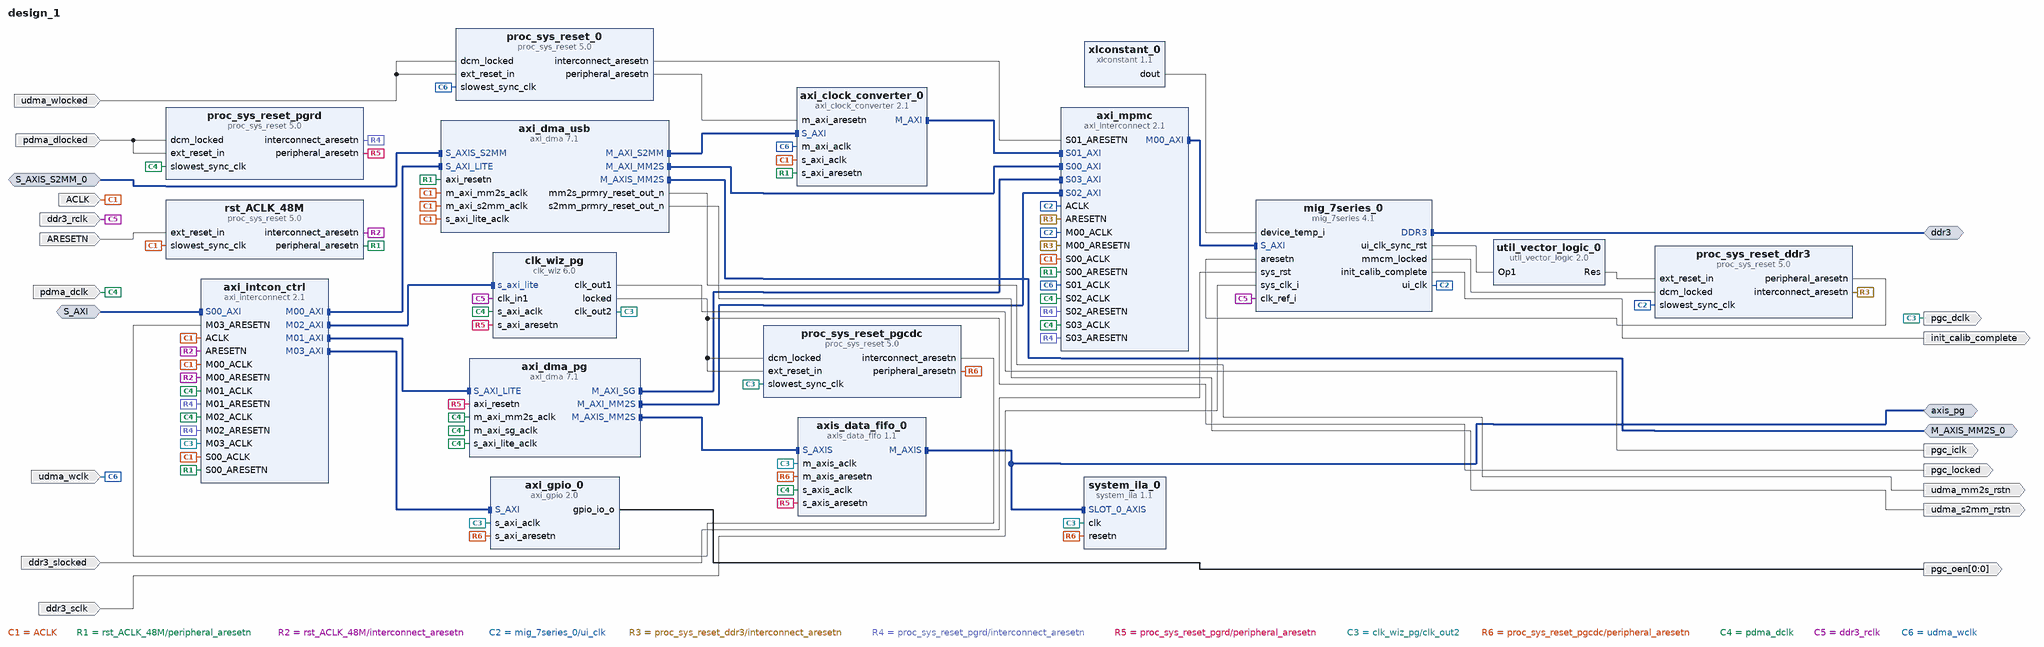
[diagram p0: block diagram of the top level]
# Vivado block design design_1, xc7a35tcsg324-1, Vivado 2018.2
create_bd_design design_1

create_bd_intf_port -mode Slave -vlnv xilinx.com:interface:axis_rtl:1.0 S_AXIS_S2MM_0
set_property -dict [list \
  CONFIG.TDATA_NUM_BYTES 4 \
  CONFIG.TDEST_WIDTH 0 \
  CONFIG.TID_WIDTH 0 \
  CONFIG.TUSER_WIDTH 0 \
  CONFIG.HAS_TREADY 1 \
  CONFIG.HAS_TSTRB 0 \
  CONFIG.HAS_TKEEP 1 \
  CONFIG.HAS_TLAST 1 \
  CONFIG.FREQ_HZ 48000000 \
  CONFIG.LAYERED_METADATA undef \
] [get_bd_intf_ports S_AXIS_S2MM_0]
create_bd_intf_port -mode Slave -vlnv xilinx.com:interface:aximm_rtl:1.0 S_AXI
set_property -dict [list \
  CONFIG.DATA_WIDTH 32 \
  CONFIG.PROTOCOL AXI4 \
  CONFIG.FREQ_HZ 48000000 \
  CONFIG.ID_WIDTH 1 \
  CONFIG.ADDR_WIDTH 32 \
  CONFIG.AWUSER_WIDTH 0 \
  CONFIG.ARUSER_WIDTH 0 \
  CONFIG.WUSER_WIDTH 0 \
  CONFIG.RUSER_WIDTH 0 \
  CONFIG.BUSER_WIDTH 0 \
  CONFIG.READ_WRITE_MODE READ_WRITE \
  CONFIG.HAS_BURST 1 \
  CONFIG.HAS_LOCK 1 \
  CONFIG.HAS_PROT 1 \
  CONFIG.HAS_CACHE 1 \
  CONFIG.HAS_QOS 1 \
  CONFIG.HAS_REGION 1 \
  CONFIG.HAS_WSTRB 1 \
  CONFIG.HAS_BRESP 1 \
  CONFIG.HAS_RRESP 1 \
  CONFIG.SUPPORTS_NARROW_BURST 0 \
  CONFIG.NUM_READ_OUTSTANDING 0 \
  CONFIG.NUM_WRITE_OUTSTANDING 0 \
  CONFIG.MAX_BURST_LENGTH 1 \
  CONFIG.NUM_READ_THREADS 1 \
  CONFIG.NUM_WRITE_THREADS 1 \
  CONFIG.RUSER_BITS_PER_BYTE 0 \
  CONFIG.WUSER_BITS_PER_BYTE 0 \
] [get_bd_intf_ports S_AXI]
create_bd_intf_port -mode Master -vlnv xilinx.com:interface:ddrx_rtl:1.0 ddr3
create_bd_intf_port -mode Master -vlnv xilinx.com:interface:axis_rtl:1.0 M_AXIS_MM2S_0
set_property -dict {CONFIG.FREQ_HZ 48000000} [get_bd_intf_ports M_AXIS_MM2S_0]
create_bd_intf_port -mode Master -vlnv xilinx.com:interface:axis_rtl:1.0 axis_pg
set_property -dict {CONFIG.FREQ_HZ 74250000} [get_bd_intf_ports axis_pg]
create_bd_port -dir I -type clk ACLK
set_property -dict {CONFIG.FREQ_HZ 48000000} [get_bd_ports ACLK]
create_bd_port -dir I ARESETN
create_bd_port -dir I ddr3_slocked
create_bd_port -dir O init_calib_complete
create_bd_port -dir O -type clk pgc_iclk
create_bd_port -dir O -type clk pgc_dclk
create_bd_port -dir O pgc_locked
create_bd_port -dir O -from 0 -to 0 pgc_oen
create_bd_port -dir I -type clk pdma_dclk
set_property -dict {CONFIG.FREQ_HZ 125000000} [get_bd_ports pdma_dclk]
create_bd_port -dir I pdma_dlocked
create_bd_port -dir I -type clk ddr3_sclk
set_property -dict {CONFIG.FREQ_HZ 400000000} [get_bd_ports ddr3_sclk]
create_bd_port -dir O -type rst udma_mm2s_rstn
create_bd_port -dir O -type rst udma_s2mm_rstn
create_bd_port -dir I -type clk ddr3_rclk
set_property -dict {CONFIG.FREQ_HZ 200000000} [get_bd_ports ddr3_rclk]
create_bd_port -dir I udma_wlocked
create_bd_port -dir I -type clk udma_wclk
set_property -dict {CONFIG.FREQ_HZ 12500000} [get_bd_ports udma_wclk]

create_bd_cell -type ip -vlnv xilinx.com:ip:proc_sys_reset:5.0 rst_ACLK_48M
create_bd_cell -type ip -vlnv xilinx.com:ip:mig_7series:4.1 mig_7series_0
set_property -dict [list \
  CONFIG.XML_INPUT_FILE mig_a.prj \
  CONFIG.RESET_BOARD_INTERFACE Custom \
  CONFIG.MIG_DONT_TOUCH_PARAM Custom \
  CONFIG.BOARD_MIG_PARAM Custom \
] [get_bd_cells mig_7series_0]
create_bd_cell -type ip -vlnv xilinx.com:ip:proc_sys_reset:5.0 proc_sys_reset_ddr3
create_bd_cell -type ip -vlnv xilinx.com:ip:util_vector_logic:2.0 util_vector_logic_0
set_property -dict {CONFIG.C_SIZE 1 CONFIG.C_OPERATION not} [get_bd_cells util_vector_logic_0]
create_bd_cell -type ip -vlnv xilinx.com:ip:proc_sys_reset:5.0 proc_sys_reset_pgrd
create_bd_cell -type ip -vlnv xilinx.com:ip:proc_sys_reset:5.0 proc_sys_reset_pgcdc
create_bd_cell -type ip -vlnv xilinx.com:ip:proc_sys_reset:5.0 proc_sys_reset_0
create_bd_cell -type ip -vlnv xilinx.com:ip:axi_clock_converter:2.1 axi_clock_converter_0
create_bd_cell -type ip -vlnv xilinx.com:ip:axi_dma:7.1 axi_dma_usb
set_property -dict [list \
  CONFIG.c_include_sg 0 \
  CONFIG.c_sg_length_width 24 \
  CONFIG.c_m_axi_mm2s_data_width 32 \
  CONFIG.c_mm2s_burst_size 16 \
  CONFIG.c_single_interface 0 \
] [get_bd_cells axi_dma_usb]
create_bd_cell -type ip -vlnv xilinx.com:ip:axi_dma:7.1 axi_dma_pg
set_property -dict [list \
  CONFIG.c_sg_length_width 26 \
  CONFIG.c_sg_include_stscntrl_strm 0 \
  CONFIG.c_m_axi_mm2s_data_width 128 \
  CONFIG.c_mm2s_burst_size 128 \
  CONFIG.c_include_s2mm 0 \
] [get_bd_cells axi_dma_pg]
create_bd_cell -type ip -vlnv xilinx.com:ip:axi_gpio:2.0 axi_gpio_0
set_property -dict {CONFIG.C_TRI_DEFAULT 0x00000000 CONFIG.C_GPIO_WIDTH 1} [get_bd_cells axi_gpio_0]
create_bd_cell -type ip -vlnv xilinx.com:ip:axi_interconnect:2.1 axi_intcon_ctrl
set_property -dict {CONFIG.NUM_MI 4} [get_bd_cells axi_intcon_ctrl]
create_bd_cell -type ip -vlnv xilinx.com:ip:axi_interconnect:2.1 axi_mpmc
set_property -dict [list \
  CONFIG.NUM_SI 4 \
  CONFIG.NUM_MI 1 \
  CONFIG.ENABLE_ADVANCED_OPTIONS 1 \
  CONFIG.XBAR_DATA_WIDTH 128 \
  CONFIG.S00_HAS_DATA_FIFO 2 \
  CONFIG.S01_HAS_DATA_FIFO 2 \
  CONFIG.S02_HAS_DATA_FIFO 2 \
  CONFIG.S03_HAS_DATA_FIFO 2 \
] [get_bd_cells axi_mpmc]
create_bd_cell -type ip -vlnv xilinx.com:ip:axis_data_fifo:1.1 axis_data_fifo_0
set_property -dict {CONFIG.FIFO_DEPTH 2048 CONFIG.IS_ACLK_ASYNC 1} [get_bd_cells axis_data_fifo_0]
create_bd_cell -type ip -vlnv xilinx.com:ip:clk_wiz:6.0 clk_wiz_pg
set_property -dict [list \
  CONFIG.USE_DYN_RECONFIG true \
  CONFIG.PRIM_IN_FREQ 200.000 \
  CONFIG.CLKIN1_JITTER_PS 50.0 \
  CONFIG.CLKOUT2_USED true \
  CONFIG.NUM_OUT_CLKS 2 \
  CONFIG.CLKOUT1_REQUESTED_OUT_FREQ 371.25 \
  CONFIG.CLKOUT2_REQUESTED_OUT_FREQ 74.25 \
  CONFIG.MMCM_DIVCLK_DIVIDE 10 \
  CONFIG.MMCM_CLKFBOUT_MULT_F 37.125 \
  CONFIG.MMCM_CLKIN1_PERIOD 5.000 \
  CONFIG.MMCM_CLKIN2_PERIOD 10.0 \
  CONFIG.MMCM_CLKOUT0_DIVIDE_F 2.000 \
  CONFIG.MMCM_CLKOUT1_DIVIDE 10 \
  CONFIG.CLKOUT1_JITTER 256.477 \
  CONFIG.CLKOUT1_PHASE_ERROR 322.999 \
  CONFIG.CLKOUT2_JITTER 333.287 \
  CONFIG.CLKOUT2_PHASE_ERROR 322.999 \
] [get_bd_cells clk_wiz_pg]
create_bd_cell -type ip -vlnv xilinx.com:ip:xlconstant:1.1 xlconstant_0
set_property -dict {CONFIG.CONST_WIDTH 12 CONFIG.CONST_VAL 0} [get_bd_cells xlconstant_0]
create_bd_cell -type ip -vlnv xilinx.com:ip:system_ila:1.1 system_ila_0
set_property -dict [list \
  CONFIG.C_SLOT_0_APC_EN 0 \
  CONFIG.C_SLOT_0_AXI_DATA_SEL 1 \
  CONFIG.C_SLOT_0_AXI_TRIG_SEL 1 \
  CONFIG.C_NUM_MONITOR_SLOTS 1 \
  CONFIG.C_SLOT_0_INTF_TYPE xilinx.com:interface:axis_rtl:1.0 \
  CONFIG.C_MON_TYPE INTERFACE \
] [get_bd_cells system_ila_0]

# ---- connections ----

connect_bd_intf_net -intf_net axi_interconnect_0_M00_AXI [get_bd_intf_pins axi_intcon_ctrl/M00_AXI] [get_bd_intf_pins axi_dma_usb/S_AXI_LITE]
connect_bd_intf_net [get_bd_intf_pins mig_7series_0/S_AXI] [get_bd_intf_pins axi_mpmc/M00_AXI]
connect_bd_intf_net -intf_net axi_dma_0_M_AXI_MM2S [get_bd_intf_pins axi_dma_usb/M_AXI_MM2S] [get_bd_intf_pins axi_mpmc/S00_AXI]
connect_bd_intf_net -intf_net axi_interconnect_0_M01_AXI [get_bd_intf_pins axi_intcon_ctrl/M01_AXI] [get_bd_intf_pins axi_dma_pg/S_AXI_LITE]
connect_bd_intf_net [get_bd_intf_pins axi_dma_pg/M_AXI_SG] [get_bd_intf_pins axi_mpmc/S03_AXI]
connect_bd_intf_net [get_bd_intf_pins axi_dma_pg/M_AXI_MM2S] [get_bd_intf_pins axi_mpmc/S02_AXI]
connect_bd_intf_net [get_bd_intf_pins axi_intcon_ctrl/M02_AXI] [get_bd_intf_pins clk_wiz_pg/s_axi_lite]
connect_bd_intf_net [get_bd_intf_pins axi_dma_pg/M_AXIS_MM2S] [get_bd_intf_pins axis_data_fifo_0/S_AXIS]
connect_bd_intf_net [get_bd_intf_pins axi_intcon_ctrl/M03_AXI] [get_bd_intf_pins axi_gpio_0/S_AXI]
connect_bd_intf_net [get_bd_intf_pins axi_dma_usb/M_AXI_S2MM] [get_bd_intf_pins axi_clock_converter_0/S_AXI]
connect_bd_intf_net [get_bd_intf_pins axi_clock_converter_0/M_AXI] [get_bd_intf_pins axi_mpmc/S01_AXI]
connect_bd_intf_net -intf_net S_AXIS_S2MM_0_1 [get_bd_intf_ports S_AXIS_S2MM_0] [get_bd_intf_pins axi_dma_usb/S_AXIS_S2MM]
connect_bd_intf_net [get_bd_intf_ports S_AXI] [get_bd_intf_pins axi_intcon_ctrl/S00_AXI]
connect_bd_intf_net [get_bd_intf_ports ddr3] [get_bd_intf_pins mig_7series_0/DDR3]
connect_bd_intf_net [get_bd_intf_ports M_AXIS_MM2S_0] [get_bd_intf_pins axi_dma_usb/M_AXIS_MM2S]
connect_bd_intf_net [get_bd_intf_ports axis_pg] [get_bd_intf_pins axis_data_fifo_0/M_AXIS]
connect_bd_intf_net [get_bd_intf_ports axis_pg] [get_bd_intf_pins system_ila_0/SLOT_0_AXIS]
connect_bd_net [get_bd_ports ACLK] \
  [get_bd_pins rst_ACLK_48M/slowest_sync_clk] [get_bd_pins axi_clock_converter_0/s_axi_aclk] \
  [get_bd_pins axi_dma_usb/s_axi_lite_aclk] [get_bd_pins axi_dma_usb/m_axi_mm2s_aclk] \
  [get_bd_pins axi_dma_usb/m_axi_s2mm_aclk] [get_bd_pins axi_intcon_ctrl/ACLK] [get_bd_pins axi_intcon_ctrl/S00_ACLK] \
  [get_bd_pins axi_intcon_ctrl/M00_ACLK] [get_bd_pins axi_mpmc/S00_ACLK]
connect_bd_net [get_bd_pins rst_ACLK_48M/peripheral_aresetn] \
  [get_bd_pins axi_clock_converter_0/s_axi_aresetn] [get_bd_pins axi_dma_usb/axi_resetn] \
  [get_bd_pins axi_intcon_ctrl/S00_ARESETN] [get_bd_pins axi_mpmc/S00_ARESETN]
connect_bd_net [get_bd_ports ARESETN] [get_bd_pins rst_ACLK_48M/ext_reset_in]
connect_bd_net [get_bd_pins rst_ACLK_48M/interconnect_aresetn] [get_bd_pins axi_intcon_ctrl/ARESETN] [get_bd_pins axi_intcon_ctrl/M00_ARESETN]
connect_bd_net [get_bd_pins xlconstant_0/dout] [get_bd_pins mig_7series_0/device_temp_i]
connect_bd_net [get_bd_ports ddr3_slocked] [get_bd_pins mig_7series_0/sys_rst]
connect_bd_net [get_bd_pins mig_7series_0/ui_clk] \
  [get_bd_pins proc_sys_reset_ddr3/slowest_sync_clk] [get_bd_pins axi_mpmc/ACLK] [get_bd_pins axi_mpmc/M00_ACLK]
connect_bd_net [get_bd_pins mig_7series_0/mmcm_locked] [get_bd_pins proc_sys_reset_ddr3/dcm_locked]
connect_bd_net [get_bd_pins mig_7series_0/ui_clk_sync_rst] [get_bd_pins util_vector_logic_0/Op1]
connect_bd_net [get_bd_pins util_vector_logic_0/Res] [get_bd_pins proc_sys_reset_ddr3/ext_reset_in]
connect_bd_net -net proc_sys_reset_0_peripheral_aresetn [get_bd_pins proc_sys_reset_ddr3/peripheral_aresetn] [get_bd_pins mig_7series_0/aresetn]
connect_bd_net [get_bd_pins mig_7series_0/init_calib_complete] [get_bd_ports init_calib_complete]
connect_bd_net -net proc_sys_reset_0_interconnect_aresetn [get_bd_pins proc_sys_reset_ddr3/interconnect_aresetn] \
  [get_bd_pins axi_mpmc/ARESETN] [get_bd_pins axi_mpmc/M00_ARESETN]
connect_bd_net -net M01_ARESETN_1 [get_bd_pins proc_sys_reset_pgrd/interconnect_aresetn] \
  [get_bd_pins axi_intcon_ctrl/M01_ARESETN] [get_bd_pins axi_intcon_ctrl/M02_ARESETN] [get_bd_pins axi_mpmc/S02_ARESETN] \
  [get_bd_pins axi_mpmc/S03_ARESETN]
connect_bd_net -net proc_sys_reset_pg_peripheral_aresetn [get_bd_pins proc_sys_reset_pgrd/peripheral_aresetn] \
  [get_bd_pins axi_dma_pg/axi_resetn] [get_bd_pins axis_data_fifo_0/s_axis_aresetn] [get_bd_pins clk_wiz_pg/s_axi_aresetn]
connect_bd_net [get_bd_pins clk_wiz_pg/clk_out1] [get_bd_ports pgc_iclk]
connect_bd_net [get_bd_pins clk_wiz_pg/clk_out2] \
  [get_bd_ports pgc_dclk] [get_bd_pins proc_sys_reset_pgcdc/slowest_sync_clk] [get_bd_pins axi_gpio_0/s_axi_aclk] \
  [get_bd_pins axis_data_fifo_0/m_axis_aclk] [get_bd_pins axi_intcon_ctrl/M03_ACLK] [get_bd_pins system_ila_0/clk]
connect_bd_net [get_bd_pins proc_sys_reset_pgcdc/peripheral_aresetn] \
  [get_bd_pins axi_gpio_0/s_axi_aresetn] [get_bd_pins axis_data_fifo_0/m_axis_aresetn] [get_bd_pins system_ila_0/resetn]
connect_bd_net [get_bd_pins clk_wiz_pg/locked] \
  [get_bd_ports pgc_locked] [get_bd_pins proc_sys_reset_pgcdc/ext_reset_in] [get_bd_pins proc_sys_reset_pgcdc/dcm_locked]
connect_bd_net [get_bd_pins proc_sys_reset_pgcdc/interconnect_aresetn] [get_bd_pins axi_intcon_ctrl/M03_ARESETN]
connect_bd_net [get_bd_pins axi_gpio_0/gpio_io_o] [get_bd_ports pgc_oen]
connect_bd_net [get_bd_ports pdma_dclk] \
  [get_bd_pins proc_sys_reset_pgrd/slowest_sync_clk] [get_bd_pins axi_dma_pg/s_axi_lite_aclk] \
  [get_bd_pins axi_dma_pg/m_axi_sg_aclk] [get_bd_pins axi_dma_pg/m_axi_mm2s_aclk] [get_bd_pins axis_data_fifo_0/s_axis_aclk] \
  [get_bd_pins clk_wiz_pg/s_axi_aclk] [get_bd_pins axi_intcon_ctrl/M01_ACLK] [get_bd_pins axi_intcon_ctrl/M02_ACLK] \
  [get_bd_pins axi_mpmc/S02_ACLK] [get_bd_pins axi_mpmc/S03_ACLK]
connect_bd_net [get_bd_ports pdma_dlocked] [get_bd_pins proc_sys_reset_pgrd/dcm_locked] [get_bd_pins proc_sys_reset_pgrd/ext_reset_in]
connect_bd_net [get_bd_ports ddr3_sclk] [get_bd_pins mig_7series_0/sys_clk_i]
connect_bd_net [get_bd_pins axi_dma_usb/mm2s_prmry_reset_out_n] [get_bd_ports udma_mm2s_rstn]
connect_bd_net [get_bd_pins axi_dma_usb/s2mm_prmry_reset_out_n] [get_bd_ports udma_s2mm_rstn]
connect_bd_net [get_bd_ports ddr3_rclk] [get_bd_pins mig_7series_0/clk_ref_i] [get_bd_pins clk_wiz_pg/clk_in1]
connect_bd_net [get_bd_ports udma_wlocked] [get_bd_pins proc_sys_reset_0/dcm_locked] [get_bd_pins proc_sys_reset_0/ext_reset_in]
connect_bd_net [get_bd_ports udma_wclk] \
  [get_bd_pins proc_sys_reset_0/slowest_sync_clk] [get_bd_pins axi_clock_converter_0/m_axi_aclk] \
  [get_bd_pins axi_mpmc/S01_ACLK]
connect_bd_net [get_bd_pins proc_sys_reset_0/peripheral_aresetn] [get_bd_pins axi_clock_converter_0/m_axi_aresetn]
connect_bd_net [get_bd_pins proc_sys_reset_0/interconnect_aresetn] [get_bd_pins axi_mpmc/S01_ARESETN]

# ---- address map ----
assign_bd_address -offset 0x00000000 -range 256M -target_address_space [get_bd_addr_spaces axi_dma_pg/Data_MM2S] [get_bd_addr_segs mig_7series_0/memmap/memaddr]
assign_bd_address -offset 0x00000000 -range 256M -target_address_space [get_bd_addr_spaces axi_dma_pg/Data_SG] [get_bd_addr_segs mig_7series_0/memmap/memaddr]
assign_bd_address -offset 0x00000000 -range 256M -target_address_space [get_bd_addr_spaces axi_dma_usb/Data_MM2S] [get_bd_addr_segs mig_7series_0/memmap/memaddr]
assign_bd_address -offset 0x00000000 -range 256M -target_address_space [get_bd_addr_spaces axi_dma_usb/Data_S2MM] [get_bd_addr_segs mig_7series_0/memmap/memaddr]
assign_bd_address -offset 0x42000000 -range 64K -target_address_space [get_bd_addr_spaces S_AXI] [get_bd_addr_segs axi_dma_usb/S_AXI_LITE/Reg]
assign_bd_address -offset 0x44000000 -range 64K -target_address_space [get_bd_addr_spaces S_AXI] [get_bd_addr_segs axi_dma_pg/S_AXI_LITE/Reg]
assign_bd_address -offset 0x80000000 -range 64K -target_address_space [get_bd_addr_spaces S_AXI] [get_bd_addr_segs axi_gpio_0/S_AXI/Reg]
assign_bd_address -offset 0xC0000000 -range 64K -target_address_space [get_bd_addr_spaces S_AXI] [get_bd_addr_segs clk_wiz_pg/s_axi_lite/Reg]

validate_bd_design
save_bd_design
